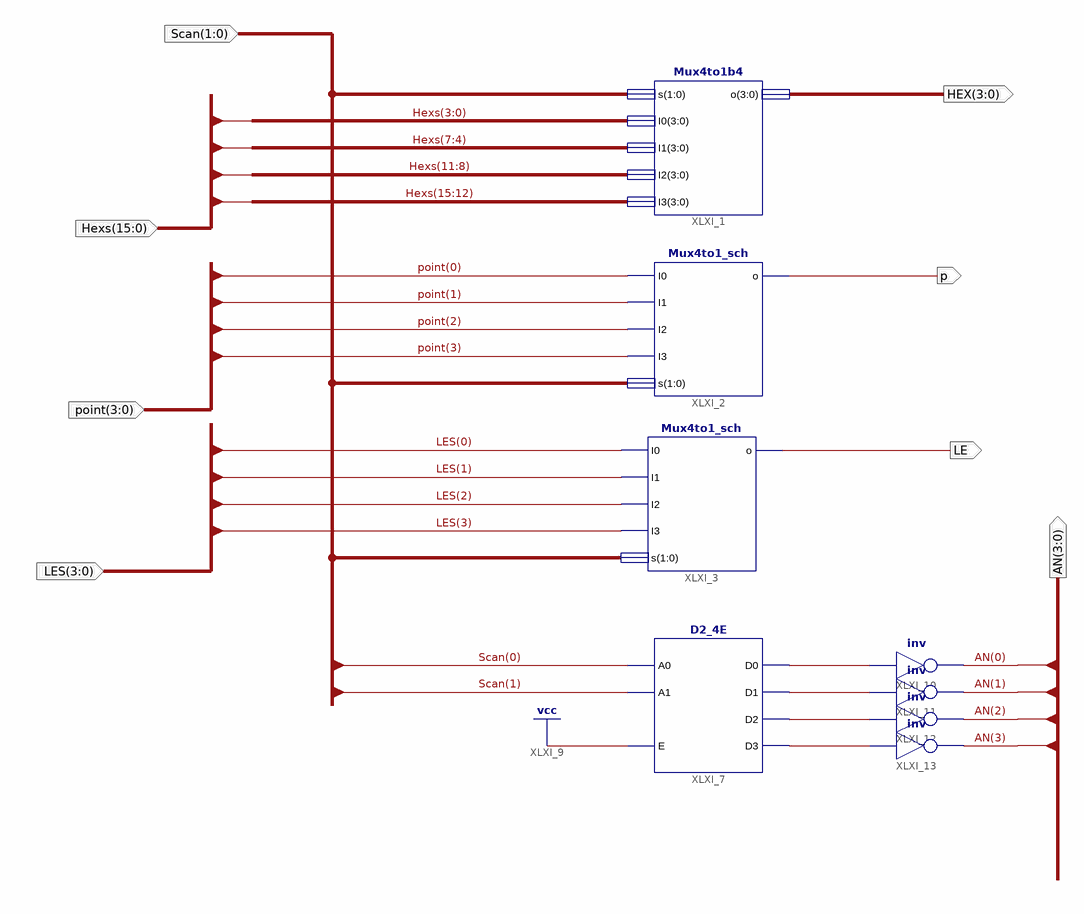
[diagram p0: schematic sheet 1]
// Xilinx ISE schematic DispSync.sch (kintex7) as structural Verilog: 8 symbols, 8 ports
module DispSync (
  input  [1:0] Scan,
  input  [15:0] Hexs,
  input  [3:0] point,
  input  [3:0] LES,
  output [3:0] HEX,
  output p,
  output LE,
  output [3:0] AN
);

  wire XLXN_28, XLXN_29, XLXN_30, XLXN_31;

  Mux4to1b4 XLXI_1 (.s(Scan), .I0(Hexs[3:0]), .I1(Hexs[7:4]), .I2(Hexs[11:8]), .I3(Hexs[15:12]), .o(HEX));
  Mux4to1_sch XLXI_2 (.I0(point[0]), .I1(point[1]), .I2(point[2]), .I3(point[3]), .s(Scan), .o(p));
  Mux4to1_sch XLXI_3 (.I0(LES[0]), .I1(LES[1]), .I2(LES[2]), .I3(LES[3]), .s(Scan), .o(LE));
  D2_4E XLXI_7 (.A0(Scan[0]), .A1(Scan[1]), .E(1'b1), .D0(XLXN_28), .D1(XLXN_29), .D2(XLXN_30), .D3(XLXN_31));
  not XLXI_10 (AN[0], XLXN_28);
  not XLXI_11 (AN[1], XLXN_29);
  not XLXI_12 (AN[2], XLXN_30);
  not XLXI_13 (AN[3], XLXN_31);
endmodule
